# Altium schematic sheet Power.SchDoc
size A
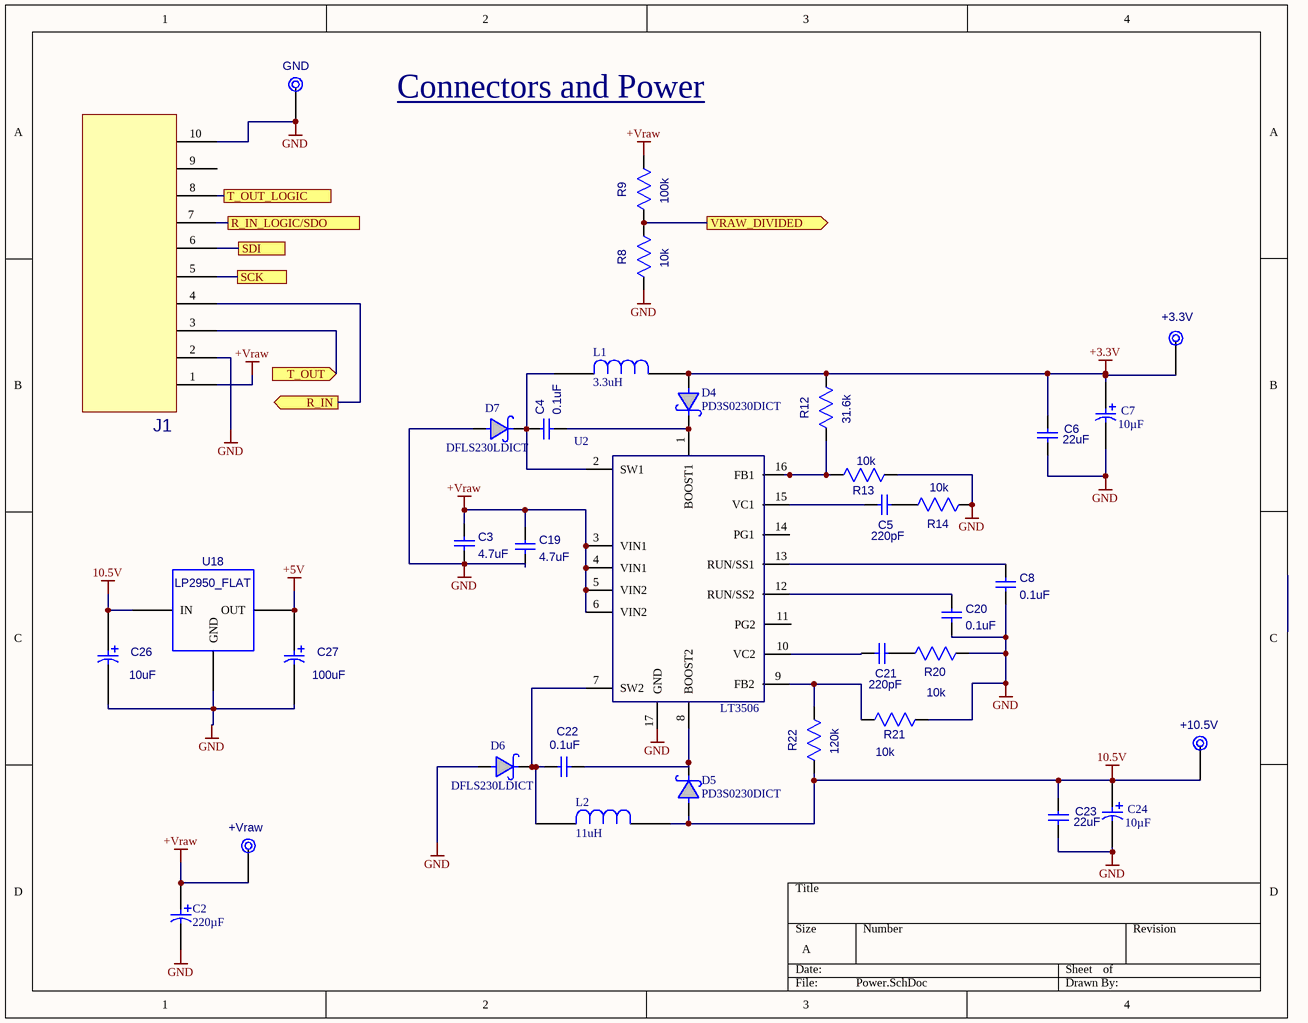
[diagram p0: Power.SchDoc]

## Parts
+5V  +3.3V  [PAD_TESTPOINT]
+10.5V  +10.5V  [PAD_TESTPOINT]
+Vraw  +Vraw  [PAD_TESTPOINT]
C2  Capacitance: 220µF  [Cap_Alu_UCL1V221MCL6GS]  (hidden comment: CAP_POL_Alu)
C3  value 4.7uF  [CC1206]  (hidden comment: CC1206)
C4  value 0.1uF  [CC1206]  (hidden comment: CC1206)
C5  value 220pF  [CC1206]  (hidden comment: CC1206)
C6  value 22uF  [CC1206]  (hidden comment: CC1206)
C7  Capacitance: 10µF  [Cap_Pol_0805]  (hidden comment: CAP_POL_0805 Generic)
C8  value 0.1uF  [CC1206]
C19  value 4.7uF  [CC1206]  (hidden comment: CC1206)
C20  value 0.1uF  [CC1206]
C21  value 220pF  [CC1206]  (hidden comment: CC1206)
C22  value 0.1uF  [CC1206]  (hidden comment: CC1206)
C23  value 22uF  [CC1206]  (hidden comment: CC1206)
C24  Capacitance: 10µF  [Cap_Pol_0805]  (hidden comment: CAP_POL_0805 Generic)
C26  value 10uF  [CAP_D_SMT_CAP_POL_D_PKG(Primary)]  (hidden comment: CAP_POL_D_PKG)
C27  value 100uF  [CAP_D_SMT_CAP_POL_D_PKG(Primary)]  (hidden comment: CAP_POL_D_PKG)
D4  PD3S0230DICT  [POWERDI123]
D5  PD3S0230DICT  [POWERDI123]
D6  DFLS230LDICT  [POWERDI123]
D7  DFLS230LDICT  [POWERDI123]
GND  GND  [PAD_TESTPOINT]
J1  TERM_BLOCK_10  [Terminal Block 10 Pos]  (value not drawn)
L1  value 3.3uH  [Inductor_Small]  (hidden comment: Inductor)
L2  value 11uH  [7447798111]  (hidden comment: Inductor)
R8  value 10k  [RC1206]  (hidden comment: RC1206)
R9  value 100k  [RC1206]  (hidden comment: RC1206)
R12  value 31.6k  [RC1206]  (hidden comment: RC1206)
R13  value 10k  [RC1206]  (hidden comment: RC1206)
R14  value 10k  [RC1206]  (hidden comment: RC1206)
R20  value 10k  [RC1206]  (hidden comment: RC1206)
R21  value 10k  [RC1206]  (hidden comment: RC1206)
R22  value 120k  [RC1206]  (hidden comment: RC1206)
U2  LT3506  [TSSOP16 Bottom Pad]
U18  LP2950_FLAT  [TO-252]

## Ports
R_IN (out), R_IN_LOGIC/SDO, SCK, SDI, T_OUT (in), T_OUT_LOGIC, VRAW_DIVIDED (out)

## Nets
10.5V: C26.plus U18.1(IN)
+3.3V: +5V.TP C6.1 C7.plus D4.A L1.1 R12.1
+5V: C27.plus U18.3(OUT)
+Vraw: +Vraw.TP C2.plus C3.1 C19.1 J1.1(P1) R9.1 U2.3(VIN1) U2.4(VIN1) U2.5(VIN2) U2.6(VIN2)
GND: C2.minus C3.2 C6.2 C7.minus C8.2 C19.2 C20.2 C23.2 C24.minus C26.minus C27.minus D6.A D7.A GND.TP J1.2(P2) J1.10(P10) R8.2 R13.2 R14.2 R20.2 R21.2 U2.17(GND) U18.2(GND)
R_IN: J1.4(P4) ; port R_IN
R_IN_LOGIC/SDO: J1.7(P7) ; port R_IN_LOGIC/SDO
SCK: J1.5(P5) ; port SCK
SDI: J1.6(P6) ; port SDI
T_OUT: J1.3(P3) ; port T_OUT
T_OUT_LOGIC: J1.8(P8) ; port T_OUT_LOGIC
VRAW_DIVIDED: R8.1 R9.2 ; port VRAW_DIVIDED
Net+10.5V_TP: +10.5V.TP C23.1 C24.plus D5.A L2.1 R22.2
NetC4_1: C4.1 D7.K L1.2 U2.2(SW1)
NetC4_2: C4.2 D4.K U2.1(BOOST1)
NetC5_1: C5.1 R14.1
NetC5_2: C5.2 U2.15(VC1)
NetC8_1: C8.1 U2.13(RUN/SS1)
NetC20_1: C20.1 U2.12(RUN/SS2)
NetC21_1: C21.1 R20.1
NetC21_2: C21.2 U2.10(VC2)
NetC22_1: C22.1 D6.K L2.2 U2.7(SW2)
NetC22_2: C22.2 D5.K U2.8(BOOST2)
NetR12_2: R12.2 R13.1 U2.16(FB1)
NetR21_1: R21.1 R22.1 U2.9(FB2)

Not connected (* = marked no-connect by the designer): J1 9(P9); U2 11(PG2) 14(PG1)

## Notes on the sheet
- Connectors and Power
- Labels drawn without touching a wire or pin: 10.5V

## Library data of the parts
+5V +10.5V +Vraw GND = PAD: Test Point; Value: *
C2 = CAP_POL_Alu: Manufacturer: Nichicon; Manufacturer Part Number: UCL1V221MCL6GS; Tolerance: ±20%; Voltage Rating: 35V; Lifetime @ Temp.: 2000 Hrs @ 105°C; Ripple Current: 850mA; Impedance: 100 mOhm; Surface Mount Land Size: 0.406" L x 0.406" W (10.30mm x 10.30mm); Supplier 1: Digi-Key; RoHS: RoHS Compliant; Category: Capacitors; Stock 1: 6274; Pricing 1: 1=1.15, 10=0.962, 25=0.8292, 50=0.7778, 100=0.6141, 250=0.51176 (USD); Packaging: Cut Tape (CT); ESR (Equivalent Series Resistance): -; Operating Temperature: -55°C ~ 105°C; Type: -; Applications: General Purpose; Lead Spacing: -; Size / Dimension: 0.394" Dia (10.00mm); Height - Seated (Max): 0.303" (7.70mm); Mounting Type: Surface Mount; Package / Case: Radial, Can - SMD; ComponentLink1URL: http://nichicon-us.com/english/products/pdfs/e-cl.pdf; ComponentLink1Description: http://nichicon-us.com/english/products/pdfs/e-cl.pdf; Supplier Part Number 1: 493-3958-1-ND
C7 C24 = CAP_POL_0805 Generic: Manufacturer: Rohm Semiconductor; Manufacturer Part Number: TCTP1C106M8R; Manufacturer Size Code: P; Tolerance: ±20%; Voltage - Rated: 16V; ESR (Equivalent Series Resistance): 6 Ohm; Type: Molded; Supplier 1: Digi-Key; Supplier Part Number 1: 511-1683-2-ND; RoHS: RoHS Compliant; Category: Capacitors; Stock 1: 99000; Pricing 1: 3000=0.2055, 6000=0.1918, 9000=0.18495, 15000=0.18221, 30000=0.1781, 75000=0.17468, 150000=0.16783 (USD); Packaging: Tape & Reel (TR); Operating Temperature: -55°C ~ 125°C; Mounting Type: Surface Mount; Package / Case: 0805 (2012 Metric); Size / Dimension: 0.079" L x 0.049" W (2.00mm x 1.25mm); Height - Seated (Max): 0.047" (1.20mm); Lead Spacing: -; Features: General Purpose; Lifetime @ Temp.: -; ComponentLink1URL: http://rohmfs.rohm.com/en/products/databook/datasheet/passive/tantalum_capacitor/tantalum_chip_capacitor/tct_p.pdf; ComponentLink1Description: http://rohmfs.rohm.com/en/products/databook/datasheet/passive/tantalum_capacitor/tantalum_chip_capacitor/tct_p.pdf
C8 C20 = CC1206
D4 D5 = PD3S0230DICT: Manufacturer: Diodes Incorporated; Manufacturer Part Number: PD3S0230-7; Diode Type: Schottky; Voltage - DC Reverse (Vr) (Max): 30V; Current - Average Rectified (Io): 200mA (DC); Voltage - Forward (Vf) (Max) @ If: 800mV @ 100mA; Speed: Small Signal =< 200mA (Io), Any Speed; Reverse Recovery Time (trr): 5ns; Current - Reverse Leakage @ Vr: 2µA @ 25V; Capacitance @ Vr, F: 10.7pF @ 1V, 1MHz; Supplier 1: Digi-Key; RoHS: RoHS Compliant; Category: Discrete Semiconductor Products; Stock 1: 4247; Pricing 1: 1=0.49, 10=0.412, 25=0.3612, 100=0.309, 250=0.268, 500=0.227, 1000=0.175 (USD); Packaging: Digi-Reel®; Mounting Type: Surface Mount; Package / Case: PowerDI™ 323; Supplier Device Package: PowerDI™ 323; Operating Temperature - Junction: -65°C ~ 125°C; ComponentLink1URL: http://www.diodes.com/datasheets/ds30722.pdf; ComponentLink1Description: http://www.diodes.com/datasheets/ds30722.pdf; Supplier Part Number 1: PD3S0230DIDKR-ND
D6 D7 = DFLS230LDICT: Manufacturer: Diodes Incorporated; Manufacturer Part Number: DFLS230L-7; Diode Type: Schottky; Voltage - DC Reverse (Vr) (Max): 30V; Current - Average Rectified (Io): 2A; Voltage - Forward (Vf) (Max) @ If: 420mV @ 2A; Speed: Fast Recovery =< 500ns, > 200mA (Io); Current - Reverse Leakage @ Vr: 1mA @ 30V; Capacitance @ Vr, F: 76pF @ 10V, 1MHz; Supplier 1: Digi-Key; RoHS: RoHS Compliant; Category: Discrete Semiconductor Products; Stock 1: 8959; Pricing 1: 1=0.74, 10=0.65, 25=0.5744, 100=0.5004, 250=0.4356, 500=0.3708, 1000=0.297 (USD); Packaging: Digi-Reel®; Reverse Recovery Time (trr): -; Mounting Type: Surface Mount; Package / Case: POWERDI®123; Supplier Device Package: PowerDI™ 123; Operating Temperature - Junction: -40°C ~ 125°C; ComponentLink1URL: http://www.diodes.com/datasheets/ds30515.pdf; ComponentLink1Description: http://www.diodes.com/datasheets/ds30515.pdf; Supplier Part Number 1: DFLS230LDIDKR-ND
L1 = Inductor: Manufacturer: Eaton Bussmann; Manufacturer Part Number: EATON SD53-3R3-R; Type: Wirewound; Material - Core: Ferrite; Inductance: 4.7µH; Tolerance: ±20%; Current Rating: 2.01A; Current - Saturation: 2.1A; Shielding: Shielded; DC Resistance (DCR): 45 mOhm Max; Frequency - Test: 100kHz; Supplier 1: Digi-Key; Supplier Part Number 1: 513-1455-1-ND; RoHS: RoHS Compliant; Category: Inductors, Coils, Chokes; Stock 1: 2548; Pricing 1: 1=1.48, 10=1.388, 50=1.11, 100=1.0545, 500=0.851, 1000=0.777 (USD); Packaging: Cut Tape (CT); Q @ Freq: -; Frequency - Self Resonant: -; Operating Temperature: -40°C ~ 125°C; Mounting Type: Surface Mount; Package / Case: Nonstandard; Size / Dimension: 0.204" L x 0.204" W (5.20mm x 5.20mm); Height - Seated (Max): 0.118" (3.00mm); Supplier Device Package: -; ComponentLink1URL: http://www.cooperindustries.com/content/dam/public/bussmann/Electronics/Resources/product-datasheets/Bus_Elx_DS_PM-4149_SD53_Series.pdf; ComponentLink1Description: http://www.cooperindustries.com/content/dam/public/bussmann/Electronics/Resources/product-datasheets/Bus_Elx_DS_PM-4149_SD53_Series.pdf
L2 = Inductor: Manufacturer: Wurth Electronics Inc; Type: Wirewound; Material - Core: Metal Composite; Inductance: 11µH; Tolerance: ±20%; Current Rating: 6.9A; Current - Saturation: 5.3A; Shielding: Shielded; DC Resistance (DCR): 15.8 mOhm Max; Frequency - Self Resonant: 25MHz; Frequency - Test: 100kHz; Supplier 1: Digi-Key; Supplier Part Number 1: 732-2414-2-ND; Manufacturer Part Number: 7447798111; RoHS: RoHS Compliant; Category: Inductors, Coils, Chokes; Stock 1: 500; Pricing 1: 500=2.49374 (USD); Packaging: Tape & Reel (TR); Q @ Freq: -; Operating Temperature: -40°C ~ 150°C; Mounting Type: Surface Mount; Package / Case: Nonstandard; Size / Dimension: 0.402" L x 0.402" W (10.20mm x 10.20mm); Height - Seated (Max): 0.252" (6.40mm); Supplier Device Package: -; ComponentLink1URL: http://katalog.we-online.de/pbs/datasheet/7447798111.pdf; ComponentLink1Description: http://katalog.we-online.de/pbs/datasheet/7447798111.pdf
U2 = LT3506: Manufacturer: Linear Technology; Manufacturer Part Number: LT3506AEFE#PBF; Output Type: Adjustable; Number of Outputs: 2; Voltage - Output: 0.8 V ~ 22 V; Voltage - Input: 3.6 V ~ 25 V; Frequency - Switching: 1.1MHz; Current - Output: 1.6A; Synchronous Rectifier: No; Supplier 1: Digi-Key; RoHS: RoHS Compliant; Category: Integrated Circuits (ICs); Stock 1: 337; Pricing 1: 1=6.13, 25=4.36, 100=3.59 (USD); Packaging: Tube; Type: Step-Down (Buck); Operating Temperature: -40°C ~ 85°C; Mounting Type: Surface Mount; Package / Case: 16-TSSOP (0.173", 4.40mm Width) Exposed Pad; Supplier Device Package: 16-TSSOP-EP; ComponentLink1URL: http://www.linear.com/docs/16297; ComponentLink1Description: http://www.linear.com/docs/16297; Supplier Part Number 1: LT3506AEFE#PBF-ND
J1 = TERM_BLOCK_10: Value: *
U18 = LP2950_FLAT: Value: *